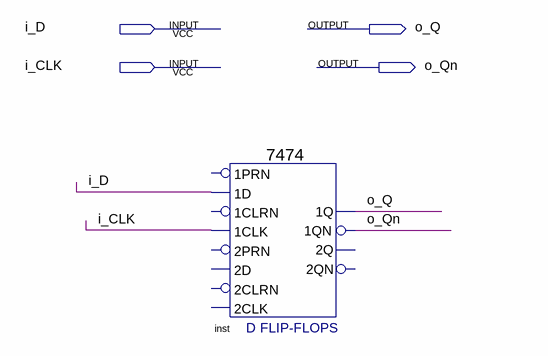
[diagram p0: schematic sheet]
// Quartus schematic ttl7474.bdf as structural Verilog: 1 symbols, 4 pins
module ttl7474 (
  input  i_D,
  input  i_CLK,
  output o_Q,
  output o_Qn
);

  \7474  inst (
    .\1CLK (i_CLK), .\1D (i_D), .\1QN (o_Qn), .\1Q (o_Q));  // open: 2D, 2PRN, 1PRN, 2CLK, 2CLRN, 1CLRN, 2Q, 2QN
endmodule
